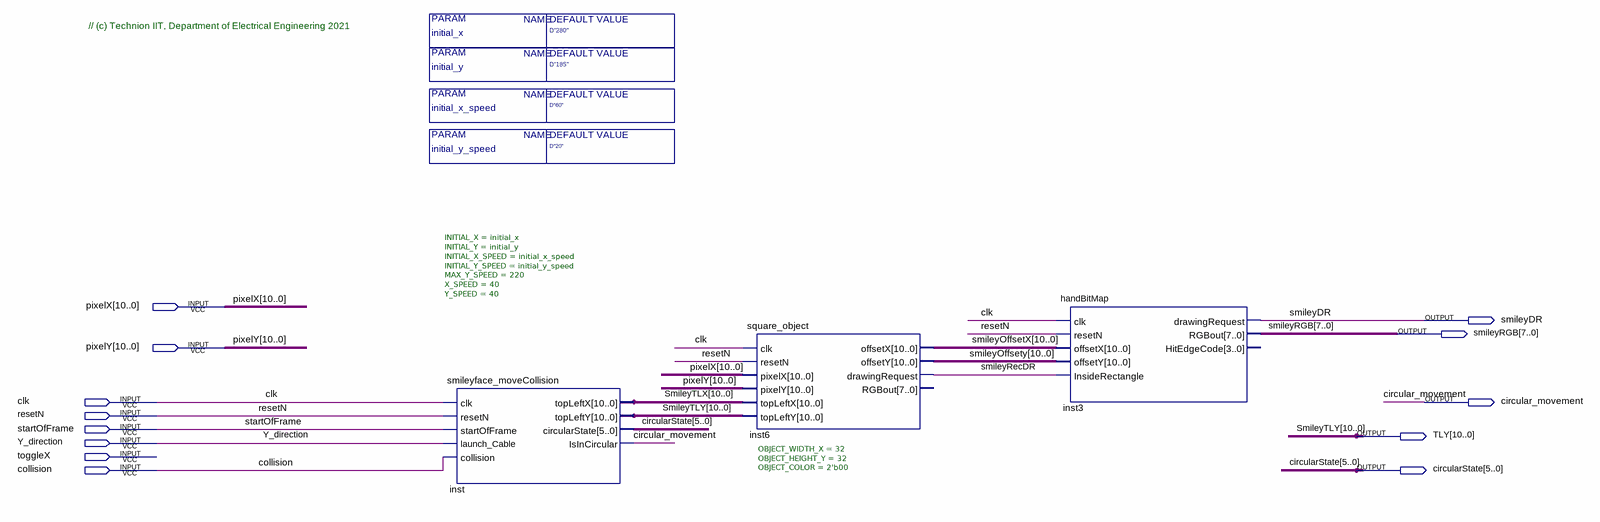
[diagram p0: schematic sheet]
// Quartus schematic Smiley_Block.bdf as structural Verilog: 3 symbols, 13 pins
module Smiley_Block #(parameter initial_x = "D\"280\"", parameter initial_y = "D\"185\"", parameter initial_x_speed = "D\"60\"", parameter initial_y_speed = "D\"20\"") (
  input  [10:0] pixelX,
  input  [10:0] pixelY,
  input  clk,
  input  resetN,
  input  startOfFrame,
  input  Y_direction,
  input  toggleX,
  input  collision,
  output smileyDR,
  output [7:0] smileyRGB,
  output circular_movement,
  output [10:0] TLY,
  output [5:0] circularState
);

  wire smileyRecDR;
  wire [10:0] smileyOffsetX, smileyOffsety, SmileyTLX;

  smileyface_moveCollision #(.INITIAL_X(initial_x), .INITIAL_Y(initial_y), .INITIAL_X_SPEED(initial_x_speed), .INITIAL_Y_SPEED(initial_y_speed), .MAX_Y_SPEED(220), .X_SPEED(40), .Y_SPEED(40)) inst (
    .clk(clk), .resetN(resetN), .startOfFrame(startOfFrame), .launch_Cable(Y_direction),
    .collision(collision), .topLeftX(SmileyTLX), .topLeftY(TLY), .circularState(circularState),
    .IsInCircular(circular_movement));
  square_object #(.OBJECT_WIDTH_X(32), .OBJECT_HEIGHT_Y(32), .OBJECT_COLOR(2'b00)) inst6 (
    .clk(clk), .resetN(resetN), .pixelX(pixelX), .pixelY(pixelY), .topLeftX(SmileyTLX), .topLeftY(TLY),
    .offsetX(smileyOffsetX), .offsetY(smileyOffsety), .drawingRequest(smileyRecDR));  // open: RGBout
  handBitMap inst3 (
    .clk(clk), .resetN(resetN), .offsetX(smileyOffsetX), .offsetY(smileyOffsety),
    .InsideRectangle(smileyRecDR), .drawingRequest(smileyDR), .RGBout(smileyRGB));  // open: HitEdgeCode

  // Other names for the same wires on the sheet: SmileyTLY[10:0] = TLY

  // Notes on the sheet:
  //   // (c) Technion IIT, Department of Electrical Engineering 2021
endmodule
